# EAGLE design PlanktoscopeHat-v0.1-fab (EAGLE 9.6.2)
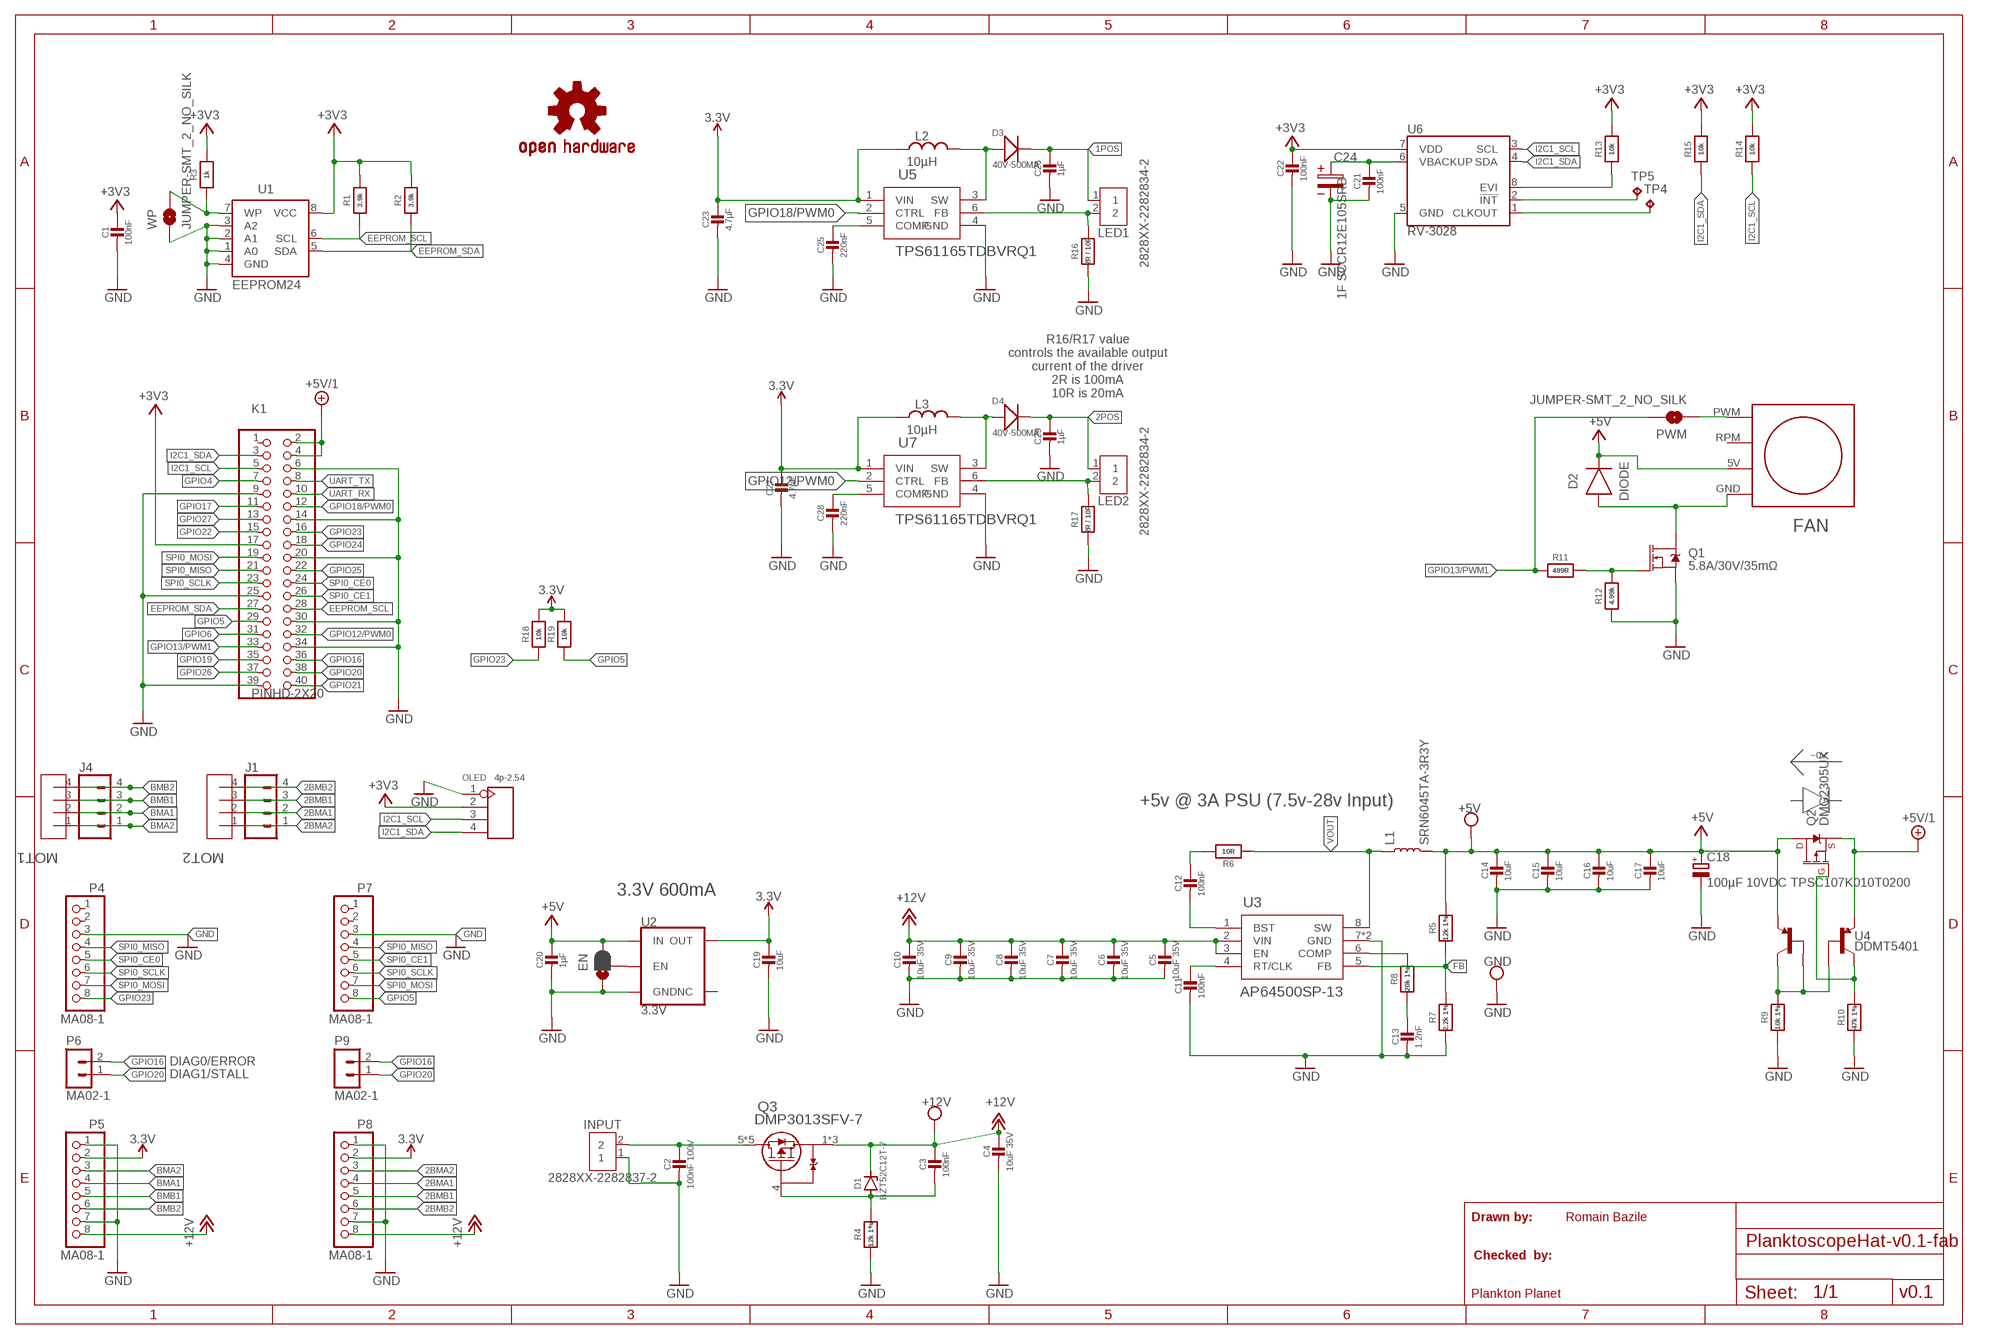
[diagram p0: schematic, sheet 1]

## Parts
+5V  TESTPOINTPAD2MM  [TESTPOINT_PAD_2MM]
+12V  TESTPOINTPAD2MM  [TESTPOINT_PAD_2MM]
C1  100nF  CAP_CERAMIC_0805MP  [_0805MP]
C2  100nF 100V  CAP_CERAMIC_0805MP  [_0805MP]
C3  100nF  CAP_CERAMIC_0805MP  [_0805MP]
C4  10uF 35V  CAP_CERAMIC_0805MP  [_0805MP]
C5  10uF 35V  CAP_CERAMIC_0805MP  [_0805MP]
C6  10uF 35V  CAP_CERAMIC_0805MP  [_0805MP]
C7  10uF 35V  CAP_CERAMIC_0805MP  [_0805MP]
C8  10uF 35V  CAP_CERAMIC_0805MP  [_0805MP]
C9  10uF 35V  CAP_CERAMIC_0805MP  [_0805MP]
C10  10uF 35V  CAP_CERAMIC_0805MP  [_0805MP]
C11  100nF  CAP_CERAMIC_0805MP  [_0805MP]
C12  100nF  CAP_CERAMIC_0805MP  [_0805MP]
C13  1.2nF  CAP_CERAMIC_0805MP  [_0805MP]
C14  10uF  CAP_CERAMIC_0805MP  [_0805MP]
C15  10uF  CAP_CERAMIC_0805MP  [_0805MP]
C16  10uF  CAP_CERAMIC_0805MP  [_0805MP]
C17  10uF  CAP_CERAMIC_0805MP  [_0805MP]
C18  100µF 10VDC TPSC107K010T0200  C-POL_TANTALUM-2412(6032-METRIC)  [CAPMP6032X280N]
C19  10uF  CAP_CERAMIC_0805MP  [_0805MP]
C20  1µF  CAP_CERAMIC_0805MP  [_0805MP]
C21  100nF  CAP_CERAMIC_0805MP  [_0805MP]
C22  100nF  CAP_CERAMIC_0805MP  [_0805MP]
C23  4.7µF  CAP_CERAMIC_0805MP  [_0805MP]
C24  1F SCCR12E105SRB  WCAP-PTHT_8X8_870135174001  [8X3.5X0.9(DXAXB)]
C25  220nF  CAP_CERAMIC_0805MP  [_0805MP]
C26  1µF  CAP_CERAMIC_0805MP  [_0805MP]
C27  4.7µF  CAP_CERAMIC_0805MP  [_0805MP]
C28  220nF  CAP_CERAMIC_0805MP  [_0805MP]
C29  1µF  CAP_CERAMIC_0805MP  [_0805MP]
D1  BZT52C12T-7  ZENER_SODFL(1608-METRIC)  [SODFL1608X70]
D2  DIODE  DIODEDO-214AC(SMA)  [DIOM5226X290N]
D3  40V-500MA  SMD-DIODE-SCHOTTKY-40V-500MA(SOD-123)  [SOD-123]
D4  40V-500MA  SMD-DIODE-SCHOTTKY-40V-500MA(SOD-123)  [SOD-123]
EN  JUMPER-SMT_3_1-NC_PASTE_SILK  [SMT-JUMPER_3_1-NC_PASTE_SILK]
FAN  40MM_FAN  [40MM_FAN]
GND  TESTPOINTPAD2MM  [TESTPOINT_PAD_2MM]
INPUT  2828XX-2282837-2  [TERMBLK_508-2N]
J1  CONN_04SCREW  [SCREWTERMINAL-3.5MM-4]
J4  CONN_04SCREW  [SCREWTERMINAL-3.5MM-4]
K1  PINHD-2X20  [2X20]
L1  SRN6045TA-3R3Y  INDUCTOR-SRN6045-33UH  [SRN6045]
L2  10µH  L_MOLDED-1210(3225-METRIC)  [INDM3225X240]
L3  10µH  L_MOLDED-1210(3225-METRIC)  [INDM3225X240]
LED1  2828XX-2282834-2  [TERMBLK_254-2N]
LED2  2828XX-2282834-2  [TERMBLK_254-2N]
LOGO1  OSHW-LOGOL-COPPER  [OSHW-LOGO-L_COPPER]
MOT1  S4B-XH-SM4-TB(LF)(SN)  [CONN_S4B-XH-SM4-TB_JST]
MOT2  S4B-XH-SM4-TB(LF)(SN)  [CONN_S4B-XH-SM4-TB_JST]
OLED  4p-2.54  DIP-BLACK-MALE-HEADER-VERT(4P-2.54)  [H4-2.54]
P4  MA08-1  PINHD-1X08_2.54-S  [1X08-S]
P5  MA08-1  PINHD-1X08_2.54-S  [1X08-S]
P6  MA02-1  [MA02-1]
P7  MA08-1  PINHD-1X08_2.54-S  [1X08-S]
P8  MA08-1  PINHD-1X08_2.54-S  [1X08-S]
P9  MA02-1  [MA02-1]
PWM  JUMPER-SMT_2_NO_SILK  [SMT-JUMPER_2_NO_SILK]
Q1  5.8A/30V/35mΩ  MOSFET-NCH-AO3404A  [SOT23-3]
Q2  DMG2305UX  MOSFET_PCH-DMG2305UX-7  [SOT23-3]
Q3  DMP3013SFV-7  [POWERDI3333-8_UX_DIO]
R1  3.9k  RESISTOR_0805MP  [_0805MP]
R2  3.9k  RESISTOR_0805MP  [_0805MP]
R3  1k  RESISTOR_0805MP  [_0805MP]
R4  12k 1%  RESISTOR_0805MP  [_0805MP]
R5  12k 1%  RESISTOR_0805MP  [_0805MP]
R6  10R  RESISTOR_0805MP  [_0805MP]
R7  2.2k 1%  RESISTOR_0805MP  [_0805MP]
R8  20k 1%  RESISTOR_0805MP  [_0805MP]
R9  10k 1%  RESISTOR_0805MP  [_0805MP]
R10  47k 1%  RESISTOR_0805MP  [_0805MP]
R11  499R  RESISTOR_0805MP  [_0805MP]
R12  4.99k  RESISTOR_0805MP  [_0805MP]
R13  10k  RESISTOR_0805MP  [_0805MP]
R14  10k  RESISTOR_0805MP  [_0805MP]
R15  10k  RESISTOR_0805MP  [_0805MP]
R16  2R / 10R  RESISTOR_0805MP  [_0805MP]
R17  2R / 10R  RESISTOR_0805MP  [_0805MP]
R18  10k  RESISTOR_0805MP  [_0805MP]
R19  10k  RESISTOR_0805MP  [_0805MP]
TP4  TPB1,27  [B1,27]
TP5  TPB1,27  [B1,27]
U1  EEPROM24  [SOIC8]
U2  3.3V  V_REG_AP2112K-3.3V  [SOT23-5]
U3  AP64500SP-13  [SO-8EP_DIO]
U4  DDMT5401  [SOT26]
U5  TPS61165TDBVRQ1  [DBV6]
U6  RV-3028  [RV-3028]
U7  TPS61165TDBVRQ1  [DBV6]
WP  JUMPER-SMT_2_NO_SILK  [SMT-JUMPER_2_NO_SILK]

## Nets
1POS: C26.1 D3.- LED1.1
2BMA1: J1.2 MOT2.2 P8.4
2BMA2: J1.1 MOT2.1 P8.3
2BMB1: J1.3 MOT2.3 P8.5
2BMB2: J1.4 MOT2.4 P8.6
2POS: C29.1 D4.- LED2.1
3.3V: C19.1 C23.1 C27.1 L2.1 L3.1 P5.2 P8.2 R18.2 R19.2 U2.5(OUT) U5.1(VIN) U7.1(VIN)
+3V3: C1.1 C22.1 K1.17 OLED.2 R1.2 R2.2 R3.2 R13.2 R14.2 R15.2 U1.8(VCC) U6.7(VDD)
+5V: +5V.P$1 C14.1 C15.1 C16.1 C17.1 C18.1(+) C20.1 D2.1(C) EN.3 FAN.5V(+5V) L1.2 Q2.3(D) R5.2 U2.1(IN) U4.D1
+5V/1: K1.2 K1.4 Q2.2(S) U4.S1
+12V: +12V.P$1 C3.1 C4.1 C5.1 C6.1 C7.1 C8.1 C9.1 C10.1 D1.1(C) P5.8 P8.8 Q3.1(S) Q3.2(S) Q3.3(S) U3.2(VIN) U3.3(EN)
/INT: TP5.TP U6.2(!INT)
BMA1: J4.2 MOT1.2 P5.4
BMA2: J4.1 MOT1.1 P5.3
BMB1: J4.3 MOT1.3 P5.5
BMB2: J4.4 MOT1.4 P5.6
CLKOUT: TP4.TP U6.1(CLKOUT)
COMP: R8.2 U3.6(COMP)
EEPROM_SCL: K1.28 R1.1 U1.6(SCL)
EEPROM_SDA: K1.27 R2.1 U1.5(SDA)
FB: R5.1 R7.2 U3.5(FB)
GND: C1.2 C2.2 C4.2 C5.2 C6.2 C7.2 C8.2 C9.2 C10.2 C11.2 C13.2 C14.2 C15.2 C16.2 C17.2 C18.2(-) C19.2 C20.2 C21.2 C22.2 C23.2 C24.2 C25.2 C26.2 C27.2 C28.2 C29.2 EN.1 GND.P$1 INPUT.1 K1.6 K1.9 K1.14 K1.20 K1.25 K1.30 K1.34 K1.39 OLED.1 P4.3 P5.1 P5.7 P7.3 P8.1 P8.7 Q1.2(S) R4.1 R7.1 R9.1 R10.1 R12.1 R16.1 R17.1 U1.1(A0) U1.2(A1) U1.3(A2) U1.4(GND) U2.2(GND) U3.7(GND) U3.EPAD(GND) U5.4(GND) U6.5(GND) U7.4(GND) WP.1
GPIO4: K1.7
GPIO5: K1.29 P7.8 R19.1
GPIO6: K1.31
GPIO12/PWM0: K1.32 U7.2(CTRL)
GPIO13/PWM1: K1.33 PWM.2 R11.1
GPIO16: K1.36 P6.2 P9.2
GPIO17: K1.11
GPIO18/PWM0: K1.12 U5.2(CTRL)
GPIO19: K1.35
GPIO20: K1.38 P6.1 P9.1
GPIO21: K1.40
GPIO22: K1.15
GPIO23: K1.16 P4.8 R18.1
GPIO24: K1.18
GPIO25: K1.22
GPIO26: K1.37
GPIO27: K1.13
I2C1_SCL: K1.5 OLED.3 R14.1 U6.3(SCL)
I2C1_SDA: K1.3 OLED.4 R15.1 U6.4(SDA)
N$3: R3.1 U1.7(WP) WP.2
N$5: C21.1 C24.1 U6.6(VBACKUP)
N$6: C3.2 D1.2(A) Q3.4(G) R4.2
N$7: EN.2 U2.3(EN)
N$8: D2.2(A) FAN.GND Q1.3(D)
N$9: C12.2 U3.1(BST)
N$10: C12.1 R6.2
N$12: Q2.1(G) R10.2 U4.D2
N$13: C11.1 U3.4(RT/CLK)
N$14: C13.1 R8.1
N$15: R9.2 U4.G1 U4.G2 U4.S2
N$17: Q1.1(G) R11.2 R12.2
N$19: FAN.PWM PWM.1
N$21: R13.1 U6.8(EVI)
N$22: C25.1 U5.5(COMP)
N$23: LED1.2 R16.2 U5.6(FB)
N$24: C28.1 U7.5(COMP)
N$25: D3.+ L2.2 U5.3(SW)
N$27: LED2.2 R17.2 U7.6(FB)
N$28: D4.+ L3.2 U7.3(SW)
SPI0_CE0: K1.24 P4.5
SPI0_CE1: K1.26 P7.5
SPI0_MISO: K1.21 P4.4 P7.4
SPI0_MOSI: K1.19 P4.7 P7.7
SPI0_SCLK: K1.23 P4.6 P7.6
UART_RX: K1.10
UART_TX: K1.8
VIN: C2.1 INPUT.2 Q3.5(D) Q3.6(D) Q3.7(D) Q3.8(D) Q3.9(D)
VOUT: L1.1 R6.1 U3.8(SW)
Unconnected: FAN.RPM K1.1 P4.1 P4.2 P7.1 P7.2 U2.4(NC)

## Notes on the sheet
- R16/R17 value
  controls the available output
  current of the driver
  2R is 100mA
  10R is 20mA
- ~0V
- +5v @ 3A PSU (7.5v-28v Input)
- 3.3V 600mA
- DIAG0/ERROR
- DIAG1/STALL
- Drawn by: | Romain Bazile
- Checked  by:
- Plankton Planet | v0.1

## Library data of the parts
+5V +12V GND = microbuilder:TESTPOINT: Test Point Various test points for characterisation and PCB testing TESTPOINT_SMT - Compact Surface Mount Test Point [Digikey: 5016KTR-ND]
C1 C21-C23 C25-C29 = microbuilder:CAP_CERAMIC: Ceramic Capacitors For new designs, use the packages preceded by an '_' character since they are more reliable: The following footprints should be used on most boards: _0402 - Standard footprint for regular board layouts _0603 - Standard footprint for regular board layouts _0805 - Standard footprint for regular board layouts _1206 - Standard footprint for regular board layouts For extremely tight-pitch boards where space is at a premium, the following 'micro-pitch' footprints can be used (smaller pads, no silkscreen outline, etc.): _0402MP - Micro-pitch footprint for very dense/compact boards _0603MP - Micro-pitch footprint for very dense/compact boards _0805MP - Micro-pitch footprint for very dense/compact boards _1206MP - Micro-pitch footprint for very dense/compact boards; DIELECTRIC: X7R
C2-C17 C19 C20 = microbuilder:CAP_CERAMIC: Ceramic Capacitors For new designs, use the packages preceded by an '_' character since they are more reliable: The following footprints should be used on most boards: _0402 - Standard footprint for regular board layouts _0603 - Standard footprint for regular board layouts _0805 - Standard footprint for regular board layouts _1206 - Standard footprint for regular board layouts For extremely tight-pitch boards where space is at a premium, the following 'micro-pitch' footprints can be used (smaller pads, no silkscreen outline, etc.): _0402MP - Micro-pitch footprint for very dense/compact boards _0603MP - Micro-pitch footprint for very dense/compact boards _0805MP - Micro-pitch footprint for very dense/compact boards _1206MP - Micro-pitch footprint for very dense/compact boards
C18 = Capacitor:C-POL: Capacitor Polarised - Generic; CATEGORY: Capacitor
C24 = Wurth_Elektronik_Passive_Capacitors_rev19a:WCAP-PTHT: WCAP-PTHT Aluminum Polymer Capacitors Characteristics Aluminum Polymer Capacitor Recommended soldering: Wave Operating temperature: -55°C to +125°C +125°C product series Low ESR at high frequency range Long life: 2000h @ +125°C Package name and Variant abbreviation: Package: D X A X B = Diameter of the outline X Pitch of the hole X Diameter of the hole. <http://katalog.we-online.de/media/images/eisos/WCAP-PTHT_pf2.jpg> Details see: http://katalog.we-online.de/en/pbs/WCAP-PTHT/ Created: 2015-02-06 2015 (C) Wurth Elektronik; WE-NUMBER: 870135174001/390uF
D1 = Diode:ZENER: Zener Diode - Generic; CATEGORY: Diode; SUB-CATEGORY: Zener; VALUE: ZENER
D2 = Diode:DIODE: Diode Rectifier - Generic; CATEGORY: Diode; SUB-CATEGORY: Rectifier
D3 D4 = OPL_Discrete_Semiconductor:SMD-DIODE-SCHOTTKY-40V-500MA(SOD-123): 304020012; MPN: B0540W
EN = SparkFun-Jumpers:JUMPER-SMT_3_1-NC_PASTE: Normally closed solder jumper (1 of 2 connections) This jumper has an aperture in the stencil to allow solder paste to bridge one of the two connections. One connection is normally closed (NC), while the other is normally open (NO). Wick off the solder to open the connection. Reapply solder to reclose the connection. Apply solder to the other side instead to change the current path.
FAN = PScope:40MM_FAN
INPUT = Connector:2828XX-2: 2 Position Wire to Board Terminal Block Horizontal with Board Datasheet <https://www.te.com.cn/commerce/DocumentDelivery/DDEController?Action=showdoc&DocId=Catalog+Section%7F1308389_EUROSTYLE_TERMINAL_BLOCKS%7F0607%7Fpdf%7FEnglish%7FENG_CS_1308389_EUROSTYLE_TERMINAL_BLOCKS_0607.pdf%7F2-282837-5>; CATEGORY: Connector; DESCRIPTION: 2 Position Wire to Board Terminal Block Horizontal with Board 5.08 mm Through Hole; MANUFACTURER: TE Connectivity; MPN: TC0203620000G; OPERATING_TEMPERATURE: -40°C to +105°C; PART_STATUS: ACTIVE; ROHS_COMPLIANCE: RoHS Compliant; SERIES: 282837; SUBCATEGORY: Terminal Block; TYPE: Side Wire Entry
J1 J4 = SparkFun-Connectors:CONN_04: Multi connection point. Often used as Generic Header-pin footprint for 0.1 inch spaced/style header connections On any of the 0.1 inch spaced packages, you can populate with these: Break Away Headers - Straight <https://www.sparkfun.com/products/116> (PRT-00116) Break Away Male Headers - Right Angle <https://www.sparkfun.com/products/553> (PRT-00553) Female Headers <https://www.sparkfun.com/products/115> (PRT-00115) Break Away Headers - Machine Pin <https://www.sparkfun.com/products/117> (PRT-00117) Break Away Female Headers - Swiss Machine Pin <https://www.sparkfun.com/products/743> (PRT-00743) For SCREWTERMINALS and SPRING TERMINALS visit here: Screw Terimnals on SparkFun.com <https://www.sparkfun.com/search/results?term=Screw+Terminals> (5mm/3.5mm/2.54mm spacing) This device is also useful as a general connection point to wire up your design to another part of your project. Our various solder wires solder well into these plated through hole pads. Hook-Up Wire - Assortment (Stranded, 22 AWG) <https://www.sparkfun.com/products/11375> (PRT-11375) Hook-Up Wire - Assortment (Solid Core, 22 AWG) <https://www.sparkfun.com/products/11367> (PRT-11367) View the entire wire category on our website here <https://www.sparkfun.com/categories/141> Special notes: Molex polarized connector foot print use with SKU : PRT-08231 with associated crimp pins and housings. 1MM SMD Version SKU: PRT-10208; PROD_ID: 2xCONN-08399; SF_ID: 2xPRT-08084
K1 = Connector:PINHD-2X20: PIN HEADER; CATEGORY: CONNECTOR; SUB-CATEGORY: PIN-HEADER
L1 = SparkFun-Coils:INDUCTOR: Inductors Resist changes in electrical current. Basically a coil of wire. SparkFun Products: SparkFun Load Cell Amplifier - HX711 <https://www.sparkfun.com/products/13879> IOIO-OTG - V2.2 <https://www.sparkfun.com/products/13613>; PROD_ID: NDUC-11627; VALUE: 33µH/±20%/1.4A
L2 L3 = Inductor:L: Inductor Fixed - Generic; CATEGORY: Inductor; MPN: CBC3225T100KR; SUB-CATEGORY: Fixed
LED1 LED2 = Connector:2828XX-2: 2 Position Wire to Board Terminal Block Horizontal with Board Datasheet <https://www.te.com.cn/commerce/DocumentDelivery/DDEController?Action=showdoc&DocId=Catalog+Section%7F1308389_EUROSTYLE_TERMINAL_BLOCKS%7F0607%7Fpdf%7FEnglish%7FENG_CS_1308389_EUROSTYLE_TERMINAL_BLOCKS_0607.pdf%7F2-282837-5>
LOGO1 = SparkFun-Aesthetics:OSHW-LOGO: Open-Source Hardware (OSHW) Logo This logo indicates the piece of hardware it is found on incorporates a OSHW license and/or adheres to the definition of open source hardware found here: http://freedomdefined.org/OSHW
MOT1 MOT2 = PScope:S4B-XH-SM4-TB(LF)(SN); BUILT_BY: EMA_Justin; COPYRIGHT: Copyright (C) 2018 Accelerated Designs. All rights reserved; DATASHEET: http://www.farnell.com/datasheets/1684882.pdf?_ga=2.23206330.1695985900.1582574926-861621671.1572890216&_gac=1.58313304.1582574926.CjwKCAiAhc7yBRAdEiwAplGxX0eXyKiGfj62eRMGG7KvwS8fdWH6vWjmriwTUSfyzPNlkVLVCkx_YhoCwGcQAvD_BwE; MANUFACTURER_PART_NUMBER: S4B-XH-SM4-TB(LF)(SN); SOURCELIBRARY: JST_2020-02-24; VENDOR: JST
OLED = OPL_Connector:DIP-BLACK-MALE-HEADER-VERT(4P-2.54): 320020017; MPN: P125-1104A0BS116A1
P4 P5 P7 P8 = pinhead-2:PINHD-1X08: PIN HEADER
P6 P9 = we-con:MA02-1: Pin Header
PWM WP = SparkFun-Jumpers:JUMPER-SMT_2_NO: Normally open jumper This jumper has two pads in close proximity to each other. Apply solder to close the connection. Round pads are easier to solder for beginners, but are a lot larger. SparkFun Product that uses the round pads: SparkFun EL Sequencer <https://www.sparkfun.com/products/12781>
Q1 = SparkFun-DiscreteSemi:MOSFET-NCH: N-channel MOSFETs Voltage controlled devices that allow control of high current outputs. SparkFun Products: SparkFun OpenScale <https://www.sparkfun.com/products/13261> SparkFun Digital Sandbox <https://www.sparkfun.com/products/12651> SparkFun Monster Moto Shield <https://www.sparkfun.com/products/10182> SparkFun MOSFET Power Controller <https://www.sparkfun.com/products/11214>; PROD_ID: TRANS-12988
Q2 = SparkFun-DiscreteSemi:MOSFET_PCH: P-channel MOSFETs Voltage controlled devices that allow control of high current outputs. SparkFun Products: SparkFun ESP32 Thing <https://www.sparkfun.com/products/13907> SparkFun ESP8266 Thing <https://www.sparkfun.com/products/13231> SparkFun Pi Servo HAT V2 <https://www.sparkfun.com/products/15316> DMG2305UX-7 (20V/4.2A/SOT23-3); PROD_ID: TRAN-14388; VALUE: 20V/4.2A/52mΩ/1.4W
Q3 = PScope:DMP3013SFV-7; BUILT_BY: EMA_Cory; COPYRIGHT: Copyright (C) 2018 Accelerated Designs. All rights reserved; DATASHEET: https://www.diodes.com/assets/Datasheets/DMP3013SFV.pdf; MANUFACTURER_PART_NUMBER: DMP3013SFV-7; SOURCELIBRARY: Diodes_Inc_2020-06-18; VENDOR: Diodes Inc
R1-R19 = microbuilder:RESISTOR: Resistors For new designs, use the packages preceded by an '_' character since they are more reliable: The following footprints should be used on most boards: _0402 - Standard footprint for regular board layouts _0603 - Standard footprint for regular board layouts _0805 - Standard footprint for regular board layouts _1206 - Standard footprint for regular board layouts For extremely tight-pitch boards where space is at a premium, the following 'micro-pitch' footprints can be used (smaller pads, no silkscreen outline, etc.): _0402MP - Micro-pitch footprint for very dense/compact boards _0603MP - Micro-pitch footprint for very dense/compact boards _0805MP - Micro-pitch footprint for very dense/compact boards _1206MP - Micro-pitch footprint for very dense/compact boards
TP4 TP5 = testpad:TP: Test pad
U1 = FLYFISH:EEPROM24
U2 = SparkFun-IC-Power:V_REG_AP2112: AP2112 - 600mA CMOS LDO Regulator w/ Enable The AP2112 is CMOS process low dropout linear regulator with enable function, the regulator delivers a guaranteed 600mA (min.) continuous load current. Features Output Voltage Accuracy: ±1.5% Output Current: 600mA (Min.) Foldback Short Current Protection: 50mA Enable Function to Turn ON/OFF VOUT Low Dropout Voltage (3.3V): 250mV (Typ.) @IOUT=600mA Excellent Load Regulation: 0.2%/A (Typ.) Excellent Line Regulation: 0.02%/V (Typ.) Low Quiescent Current: 55μA (Typ.) Low Standby Current: 0.01μA (Typ.) Low Output Noise: 50μVRMS PSRR: 100Hz -65dB, 1kHz -65dB OTSD Protection Stable with 1.0μF Flexible Cap: Ceramic, Tantalum and Aluminum Electrolytic Operation Temperature Range: -40°C to 85°C ESD: MM 400V, HBM 4000V; PROD_ID: VREG-12457
U3 = PScope:AP64500SP-13; BUILT_BY: EMA_Cory; COPYRIGHT: Copyright (C) 2018 Accelerated Designs. All rights reserved; DATASHEET: https://www.diodes.com/assets/Datasheets/AP64500.pdf; MANUFACTURER_PART_NUMBER: AP64500SP-13; SOURCELIBRARY: Diodes_Inc_2020-08-19; VENDOR: Diodes Inc
U4 = SparkFun-DiscreteSemi:DDMT5401
U5 U7 = PScope:TPS61165TDBVRQ1; DATASHEET_URL: http://www.ti.com/lit/gpn/TPS61165-Q1; DESCRIPTION: Automotive Catalog High Brightness White LED Driver in 2mm x 2mm QFN Package; FAMILY_NAME: WHITE LED DRIVER; GENERIC_PART_NUMBER: TPS61165-Q1; INDUSTRY_STD_PKG_TYPE: SOT-23; MANUFACTURER: Texas Instruments; MANUFACTURER_PART_NUMBER: TPS61165TDBVRQ1; PACKAGE_DESIGNATOR: DBV; PIN_COUNT: 6; VENDOR: Texas Instruments
U6 = SparkFun-Clocks:RV-3028: RV-3028 - RTC with I2C Bus Specifications: Pin count: 8 Pin pitch: .9mm Area: [3.2mm x 2.0mm] Datasheet referenced for footprint <https://www.microcrystal.com/fileadmin/Media/Products/RTC/App.Manual/RV-3028-C7_App-Manual.pdf>; PROD_ID: IC-14378

## Board
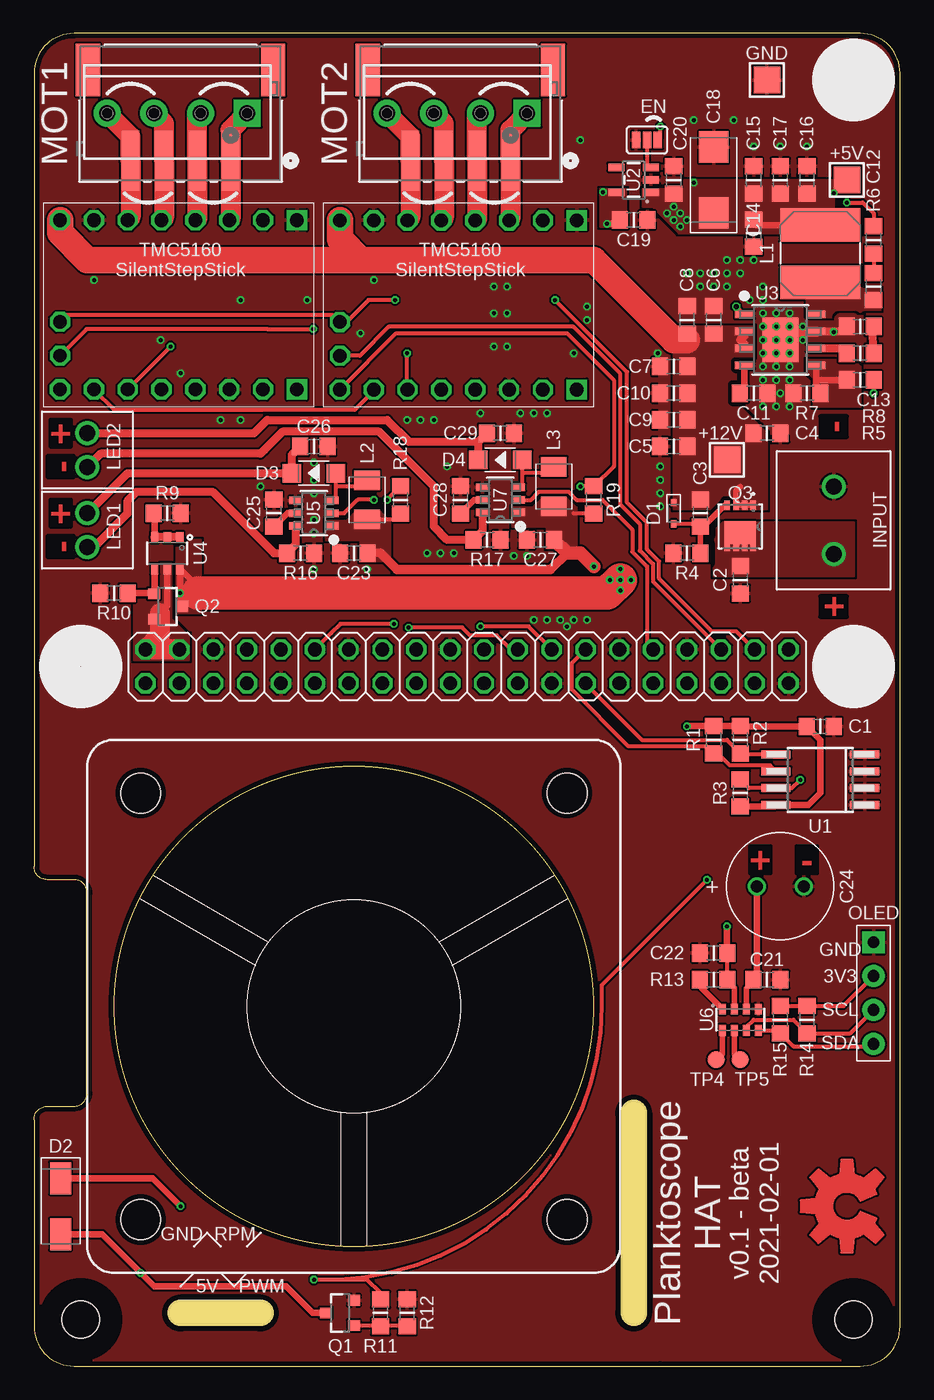
[diagram p1: board, top side]
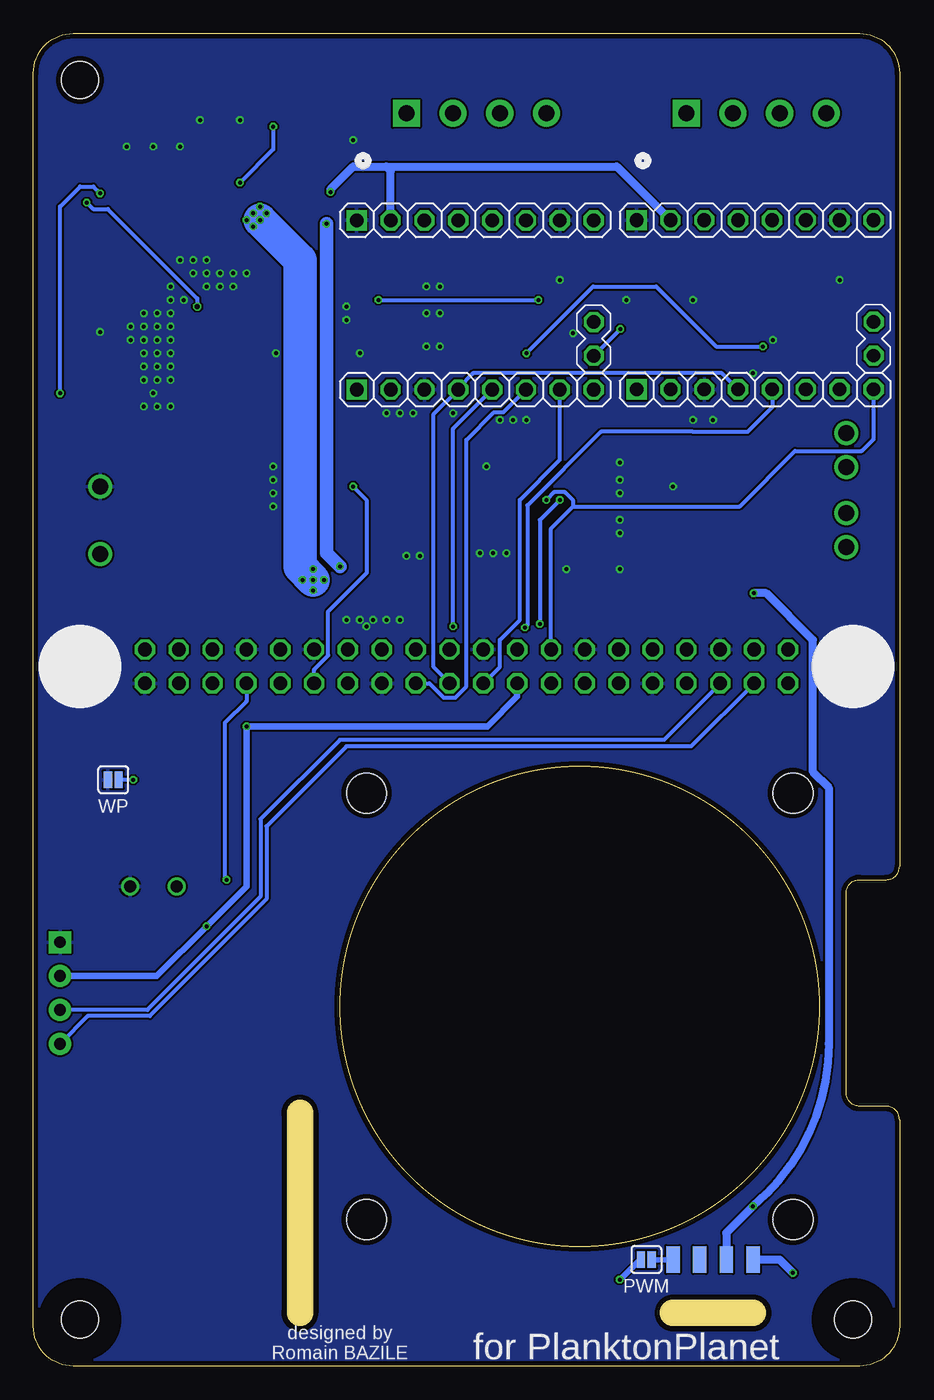
[diagram p2: board, bottom side, seen from below]

Size 65 x 100 mm. Coordinates in mm from the lower left corner, seen from the top.
Outline: 45,19 45,4
Outline: 0,3 arc90 3,0 47,0 62,0 arc90 65,3 65,97 arc90 62,100 3,100 arc90 0,97 0,37.5 arc90 1,36.5 3,36.5 arc-90 4,35.5 4,20.5 arc-90 3,19.5 1,19.5 arc90 0,18.5 0,3
Outline: circle at 24,27 radius 18
Copper layers (1*16): Top 0.035559375mm / dielectric 1.6mm / Bottom 0.035559375mm
Design rules "oshpark-2layer *": minimum track width 6mil, minimum drill 10mil, track to track 6mil, track to pad 6mil, pad to pad 6mil, via to via 6mil, smd to smd 0mil, copper to edge 15mil, drill to drill 6mil, minimum pad ring 5mil, minimum via ring 5mil, stop-mask expansion 2.5mil, vias tented up to drill 0.35mm, thermal gap 6mil
Holes 2.8 mm at 3.5,3.5 3.5,52.5 61.5,52.5 61.5,3.5 61.5,96.5
tRestrict: area 60,1.9 to 63,5; area 1.9,1.9 to 5,5
bRestrict: area 1.9,1.9 to 5,5; area 60,1.9 to 63,5
Milling: 1 lines

### Footprints (pad centres in the part's own frame; a part is rotated, then mirrored left to right if it is on the bottom)
TESTPOINT_PAD_2MM = smd 2 x 2: P$1 0,0
_0805MP = smd 1.2 x 1.3: 1 -1.016,0; 2 1.016,0
CAPMP6032X280N = smd 2.368 x 2.204: 1 -2.471,0; 2 2.471,0
8X3.5X0.9(DXAXB) = drill 0.9: 1 1.75,0; 2 -1.75,0
SODFL1608X70 = smd 0.538 x 0.4: 1 -0.796,0; 2 0.796,0
DIOM5226X290N = smd 2.392 x 1.565: 1 -2.108,0; 2 2.108,0
SOD-123 = smd 1.397 x 1.397: + -1.651,0; - 1.651,0
SMT-JUMPER_3_1-NC_PASTE_SILK = smd 0.635 x 1.27: 1 -0.813,0; 2 0,0; 3 0.813,0
40MM_FAN = smd 1 x 2 bottom: 5V 11,19; GND 13,19; PWM 7,19; RPM 9,19 | hole 3: -16,16; 16,16; 16,-16; -16,-16
TERMBLK_508-2N = drill 1.2: 1 0,0; 2 5.08,0
SCREWTERMINAL-3.5MM-4 = drill 1.2 pad 2.032 square: 1 0,0 | drill 1.2 pad 2.032: 2 3.5,0; 3 7,0; 4 10.5,0
2X20 = drill 1.016 octagon: 1 -24.13,-1.27; 2 -24.13,1.27; 3 -21.59,-1.27; 4 -21.59,1.27; 5 -19.05,-1.27; 6 -19.05,1.27; 7 -16.51,-1.27; 8 -16.51,1.27; 9 -13.97,-1.27; 10 -13.97,1.27; 11 -11.43,-1.27; 12 -11.43,1.27; 13 -8.89,-1.27; 14 -8.89,1.27; 15 -6.35,-1.27; 16 -6.35,1.27; 17 -3.81,-1.27; 18 -3.81,1.27; 19 -1.27,-1.27; 20 -1.27,1.27; 21 1.27,-1.27; 22 1.27,1.27; 23 3.81,-1.27; 24 3.81,1.27; 25 6.35,-1.27; 26 6.35,1.27; 27 8.89,-1.27; 28 8.89,1.27; 29 11.43,-1.27; 30 11.43,1.27; 31 13.97,-1.27; 32 13.97,1.27; 33 16.51,-1.27; 34 16.51,1.27; 35 19.05,-1.27; 36 19.05,1.27; 37 21.59,-1.27; 38 21.59,1.27; 39 24.13,-1.27; 40 24.13,1.27
SRN6045 = smd 2.5 x 6: 1 -2.175,0; 2 2.125,0
INDM3225X240 = smd 1.459 x 1.929: 1 -1.478,0; 2 1.478,0
TERMBLK_254-2N = drill 1.2: 1 0,0; 2 2.54,0
CONN_S4B-XH-SM4-TB_JST = smd 1.295 x 4.496: 1 -3.75,3.552; 2 -1.25,3.552; 3 1.25,3.552; 4 3.75,3.552 | smd 1.803 x 3.912: 5 -6.95,-3.248; 6 6.95,-3.248
H4-2.54 = drill 0.889 pad 1.651 square: 1 0,3.81 | drill 0.889 pad 1.651: 2 0,1.27; 3 0,-1.27; 4 0,-3.81
1X08-S = drill 1.016 square: 1 -8.89,0 | drill 1.016 octagon: 2 -6.35,0; 3 -3.81,0; 4 -1.27,0; 5 1.27,0; 6 3.81,0; 7 6.35,0; 8 8.89,0
MA02-1 = drill 1 octagon: 1 0,1.27; 2 0,-1.27
SMT-JUMPER_2_NO_SILK = smd 0.635 x 1.27: 1 -0.406,0; 2 0.406,0
SOT23-3 = smd 0.8 x 0.9: 1 -0.95,-1; 2 0.95,-1; 3 0,1.1
POWERDI3333-8_UX_DIO = smd 0.7 x 0.42: 1 -1.598,0.975; 2 -1.598,0.325; 3 -1.598,-0.325; 4 -1.598,-0.975 | smd 0.54 x 0.42: 5 1.578,-0.975; 6 1.578,-0.325; 7 1.578,0.325; 8 1.578,0.975 | smd 1.71 x 2.37: 9 0.455,0
B1,27 = smd 1.27 x 1.27: TP 0,0
SOIC8 = smd 0.6 x 2.2: 1 -1.905,-3.33; 2 -0.635,-3.33; 3 0.635,-3.33; 4 1.905,-3.33; 5 1.905,3.33; 6 0.635,3.33; 7 -0.635,3.33; 8 -1.905,3.33
SOT23-5 = smd 0.55 x 1.2: 1 -0.95,-1.3; 2 0,-1.3; 3 0.95,-1.3; 4 0.95,1.3; 5 -0.95,1.3
SO-8EP_DIO = smd 1.417 x 0.558: 1 -2.69,1.905; 2 -2.69,0.635; 3 -2.69,-0.635; 4 -2.69,-1.905; 5 2.69,-1.905; 6 2.69,-0.635; 7 2.69,0.635; 8 2.69,1.905 | smd 2.718 x 3.353: EPAD 0,0
SOT26 = smd 0.55 x 0.8: D1 -0.95,1.2; D2 0.95,1.2; G1 -0.95,-1.2; G2 0.95,-1.2; S1 0,1.2; S2 0,-1.2
DBV6 = smd 0.972 x 0.558: 1 -1.362,0.95; 2 -1.362,0; 3 -1.362,-0.95; 4 1.362,-0.95; 5 1.362,0; 6 1.362,0.95
RV-3028 = smd 0.5 x 0.8: 1 -1.35,-0.8; 2 -0.45,-0.8; 3 0.45,-0.8; 4 1.35,-0.8; 5 1.35,0.8; 6 0.45,0.8; 7 -0.45,0.8; 8 -1.35,0.8

### Placement (x,y rotation side)
+5V  61,89 270 top
+12V  52,68 90 top
C1  59,48 0 top
C2  53,59 270 top
C3  50,64 270 top
C4  55,70 0 top
C5  48,69 180 top
C6  51,78.5 90 top
C7  48,75 180 top
C8  49,78.5 90 top
C9  48,71 180 top
C10  48,73 180 top
C11  54,73 0 top
C12  63,84.5 90 top
C13  62,78 180 top
C14  54,85 270 top
C15  54,89 90 top
C16  58,89 90 top
C17  56,89 90 top
C18  51,89 90 top
C19  45,86 0 top
C20  48,89 90 top
C21  55,29 0 top
C22  51,31 180 top
C23  24,61 180 top
C24  56,36 180 top
C25  18,64 90 top
C26  21,69 0 top
C27  38,62 180 top
C28  32,65 90 top
C29  35,70 0 top
D1  48,64 270 top
D2  2,12 270 top
D3  21,67 180 top
D4  35,68 180 top
EN  46,92 0 top
FAN  24,27 180 top
GND  55,96.5 270 top
INPUT  60,66 270 top
J1  37,94 180 top
J4  16,94 180 top
K1  32.5,52.5 0 top
L1  59,83.5 90 top
L2  25,65 90 top
L3  39,66 90 top
LED1  4,64 270 top
LED2  4,70 270 top
LOGO1  61,12 90 top
MOT1  11,94 180 top
MOT2  32,94 180 top
OLED  63,28 0 top
P4  10.84,73.28 0 bottom
P5  10.84,85.98 0 bottom
P6  1.95,77.09 0 bottom
P7  31.84,73.27 0 bottom
P8  31.84,85.97 0 bottom
P9  22.95,77.08 0 bottom
PWM  19,8 180 bottom
Q1  23,4 90 top
Q2  10,57 270 top
Q3  53,63 270 top
R1  51,47 90 top
R2  53,47 90 top
R3  53,43.01 270 top
R4  49,61 0 top
R5  62,74 0 top
R6  63,81 90 top
R7  58,73 0 top
R8  62,76 180 top
R9  10,64 180 top
R10  6,58 0 top
R11  26,4 270 top
R12  28,4 270 top
R13  51,29 0 top
R14  58,26 90 top
R15  56,26 90 top
R16  20,61 180 top
R17  34,62 180 top
R18  27.5,65 270 top
R19  42,65 270 top
TP4  51.2,23 0 top
TP5  53,23 0 top
U1  59,44 90 top
U2  45,89 90 top
U3  56,77 0 top
U4  10,61 180 top
U5  21,64 180 top
U6  53,26 0 top
U7  35,65 180 top
WP  59,44 0 bottom

### Tracks (layer width: path | path; a pad name or v marks a point on that pad's centre or on a via)
1POS
  Top 0.6: LED1.1 4.03,64 7.03,67 D3.- 19.35,68.36 C26.1
2BMA1
  Top 1.5: J1.2 33.25,93.75 MOT2.2 33.25,86.11 P8.4
2BMA2
  Top 1.5: J1.1 35.75,92.75 MOT2.1 35.75,86.07 P8.3
2BMB1
  Top 1.5: J1.3 30.75,93.25 MOT2.3 30.75,86.15 P8.5
2BMB2
  Top 1.5: J1.4 28.25,92.25 MOT2.4 28.25,86.19 P8.6
2POS
  Top 0.6: LED2.1 16.5,70 17.5,71 26.5,71 28.14,69.36 33.35,69.36 | D4.- 33.35,69.36 | 33.35,69.36 C29.1
3.3V  (via drill 0.3)
  Top 0.3: R19.2 40.52,63.98 40.5,64 | R18.2 27.04,63.52 L2.1
  Top 0.5: C19.1 43.68,85.7 v43,85.7
  Top 0.6: 26,61 C23.1
  Top 0.7: 40.02,61 38.77,59.75 27.25,59.75 26,61
  Top 1: v42,60 41,61 40.02,61 C27.1
  Bottom 0.6: v42.7,88.1 42.7,88.3 41,90 38.5,90 | P5.2 21.21,90 38.5,90 | P8.2 38.19,89.69 38.5,90
  Bottom 1: v43,85.7 43,61 v42,60
  pour Top (isolate 0.3, no thermals): 44.4,88.3 42.5,88.3 42.5,85.5 44.4,85.5
  pour Top (no thermals): 21.9,63.4 23.4,63.4 24.1,64.1 26,64.1 26.7,63.4 26.7,60.4 24.5,60.4 24.5,62 21.9,62
  pour Top (no thermals): 35.9,64.4 37.4,64.4 38.1,65.1 40,65.1 40.7,64.4 40.7,61.4 38.5,61.4 38.5,63 35.9,63
+3V3  (via drill 0.3)
  Top 0.3: R13.2 C22.1 | R15.2 R14.2 60.75,27.02 OLED.2
  Top 0.4: U6.7 52.55,28.37 R13.2
  Top 0.5: R3.2 55.56,41.99 U1.8 58.09,42.09 59,43 59,46.98 C1.1 53.02,48 R2.2 R1.2 49.02,48.02 v49,48 | v52,33 52,31.02 C22.1
  Bottom 0.5: K1.17 28.69,50.23 30.92,48 v49,48 49,36 v52,33 55.73,29.27 OLED.2
+5V  (via drill 0.3)
  Top 0.3: EN.3 47,92.19 v47,93 | R5.2 63,73.92 v63,73 | v43.2,59 v44,59 | v44,59.8 v44,59 | v44.8,59 v44,59 | v44,58.2 v44,59
  Top 0.5: Q2.3 10.95,57.15 v10.95,58 U4.D1 12.3,58.45 12.3,58 | L1.2 54.25,85.62 C14.1 | D2.1 6,14.11 8.89,14.11 v11,12
  Top 2.5: 12.3,58 39,58 43,58 v44,59
  Bottom 0.3: v47,93 47,91.3 v49.5,88.8 | v63,73 63,87 61.5,88.5 60.5,88.5 v60,88
  Bottom 0.6: v10.95,58 10,58 6.5,54.5 6.5,44.58 5.32,43.4 5.32,24.18 arc50 v11,12 13,10 FAN.5V
  Bottom 2.5: v44,59 45,60 45,83 v48,86
  other vias: 49,86 48,87 48.5,86.5 47.5,86.5 48.5,85.5
  pour Top (no thermals): 60,85 48.4,85 46.4,87 45.7,87 45.7,88.3 48.8,88.3 48.8,89 60,89
  pour Top (isolate 0.3, no thermals): 10.7,56.5 12.5,56.5 12.5,62 10.7,62
+5V/1
  Top 0.5: U4.S1 10,57.05 9.47,56.52 9.45,56.5 Q2.2
  Top 1.5: 9.45,56.5 9.45,54.85 K1.2 K1.4
  pour Top (no thermals): 9.5,60.2 10.3,60.2 10.3,56.1 11.5,54.9 11.6,54.9 11.6,53 7.5,53 7.5,57.5 9.5,57.5
+12V
  Top 0.4: Q3.1 Q3.2 Q3.3 52.67,65.67 53,66
  Top 0.6: U3.3 53.31,76.69 53,77 53.31,77.31 U3.2
  Top 2: 49,77 48,77 42,83 24.5,83 | P5.8 1.95,85.05 4,83 24.5,83 | P8.8 22.95,84.55 24.5,83
  pour Top (isolate 0.3, no thermals): 53,75 53,72 55,70 55,64.3 48,64.3 48,78 54,78 54,75
/INT
  Top 0.4: U6.2 52.55,23.45 TP5.TP
BMA1
  Top 1.5: J4.2 12.25,93.75 MOT1.2 12.25,86.12 P5.4
BMA2
  Top 1.5: J4.1 14.75,92.75 MOT1.1 14.75,86.08 P5.3
BMB1
  Top 1.5: J4.3 9.75,93.25 MOT1.3 9.75,86.16 P5.5
BMB2
  Top 1.5: J4.4 7.25,92.25 MOT1.4 7.25,86.2 P5.6
CLKOUT
  Top 0.4: U6.1 51.65,23.45 TP4.TP
COMP
  Top 0.6: U3.6 60.72,76.36 R8.2
EEPROM_SCL
  Top 0.3: K1.28 40.33,52.71 40.33,51 | 40.33,50.79 40.33,51 | 40.33,51 40.33,50.79 | 40.33,50.79 44.57,46.55 50.44,46.55 R1.1 51.32,45.98 52.23,45.08 55.22,45.08 U1.6
EEPROM_SDA
  Top 0.3: K1.27 45.62,47 52,47 53,46 R2.1 53.08,45.91 U1.5
FB
  Top 0.5: U3.5 58.69,75 58.69,74 | 58.69,74 58.69,73.23 R7.2 | R5.1 58.69,74
  pour Top (no thermals): 58,75.5 61.5,75.5 62,75 62,72 58.5,72 58.5,74.1 58,74.6
GND  (via drill 0.3)
  Top 0.5: 55.7,77.64 v55.7,77
  Top 0.6: C13.2 60.76,77.64 U3.7
  Top 0.8: U3.7 55.7,77.64
  other vias: 54.7,79 55.7,79 55.7,75 56.7,75 54.7,75 56.7,79 57.7,77 60,77.6 54.7,78 54.7,77 54.7,76 55.7,78 55.7,76 56.7,76 56.7,77 56.7,78 57.7,78 54.7,80 53.7,80 55.7,74 56.7,74 56,73 51,81 54,83 52,81 50,81 54.7,81 51,82 52,83 52,82 53,82 53,83 39.5,56 30.5,61 36,60.8 40.5,56 41.5,56 29.5,61 21,62.5 37,60.8 25,59.8 21,59.8 21,67.8 28,71 29,71 30,71 33.5,71.5 36.5,71.5 37.5,71.5 31.5,61 21,63.5 21,65.5 21,66.5 17,66 31,67.5 38.5,71.5 47,67.5 47,66.5 47,65.5 50,82 49,82 58,91.5 56,91.5 54,91.5 49.5,93.5 52.5,93.5 25.5,81.5 4.5,81.5 11,74.5 9.5,77 15.5,71 14,71 38.5,56 37.5,56 40,55.5 54.7,74 56.7,72 55.7,72 54.7,72 34.5,79 35.5,79 34.5,81 35.5,81 34.5,76.5 35.5,76.5 24.5,77.5 20.5,80 15.5,80 41,92 40.5,76 41.5,78.5 46.8,76 41.5,79.5 47,64.5
  pour Bottom: 0,3 arc90 3,0 62,0 arc90 65,3 65,97 arc90 62,100 3,100 arc90 0,97
  pour Top (rank 2): 0,3 arc90 3,0 62,0 arc90 65,3 65,97 arc90 62,100 3,100 arc90 0,97
  pour Top (rank 2, no thermals): 47,81 62,81 62,70 47,70
GPIO5  (via drill 0.3)
  Top 0.3: v41,66 41.02,66.02 R19.1 42.02,66.02 43.5,67.5 43.5,74 40,77.5 27.18,77.5 P7.8
  Bottom 0.3: K1.29 43.93,52.27 42.87,53.33 42.87,56.63 40,59.5 40,65 v41,66
GPIO12/PWM0
  Top 0.3: U7.2 37.29,65 37.89,65.6 40.11,65.6 40.71,65 42.66,65 44.9,62.76 44.9,61.1 46,60 46,54.24 K1.32
GPIO13/PWM1  (via drill 0.3)
  Top 0.3: R11.1 26,5.5 25,6.5 v21,6.5 arc93 42.58,27 42.58,28.58 v50.5,36.5
  Bottom 0.3: K1.33 49.01,49.88 50.63,48.26 50.63,36.63 v50.5,36.5
  Bottom 0.4: v21,6.5 19.5,8 PWM.2
GPIO16  (via drill 0.3)
  Top 0.3: P6.2 3.95,77.82 17.5,77.81 v20.95,77.81 | K1.36 46.45,58.87 46.45,60.19 45.45,61.19 45.45,63.19 44,64.64 44,74.46 40.48,77.98 26.62,77.98 24.45,75.81 P9.2
  Bottom 0.3: v20.95,77.81 P9.2
GPIO18/PWM0  (via drill 0.3)
  Top 0.3: U5.2 23.29,64 24.29,65 v25.5,65 | v27,55.7 26.7,55.7 23,55.7 22.3,55 K1.12
  Bottom 0.3: v25.5,65 27,63.5 v27,55.7
GPIO20  (via drill 0.3)
  Top 0.3: P6.1 2.45,78.86 22.45,78.85 P9.1 23.45,78.35 25.1,80 v27.1,80 | K1.38 54.05,53.77 52.69,55.13 50.87,55.13 46.91,59.09 46.91,60.38 46,61.28 46,63.28 44.5,64.78 44.5,74.6 v39.1,80
  Bottom 0.3: v39.1,80 v27.1,80
GPIO23  (via drill 0.3)
  Top 0.3: v26.5,65 26.5,65.02 R18.1
  Bottom 0.3: K1.16 26.15,62.85 24.5,64.5 24.49,64.5 24.47,64.5 | 24.47,64.5 24.47,64.93 25.12,65.58 25.92,65.58 v26.5,65 | P4.8 1.95,69.55 2.84,68.66 7.84,68.66 12,64.5 24.47,64.5
I2C1_SCL
  Top 0.3: U6.3 53.45,25.45 54,26 56.98,26 R14.1 61.25,24.98 OLED.3
  Bottom 0.3: K1.5 17.68,47 39,47 42,47 47.95,41.05 47.95,35.23 56.45,26.73 OLED.3
I2C1_SDA
  Top 0.3: OLED.4 62.81,24 56.98,24 R15.1 55.78,25.2 U6.4
  Bottom 0.3: K1.3 15.64,46.5 41.5,46.5 47.49,40.51 47.49,35.05 56.26,26.28 60.91,26.28 OLED.4
N$3  (via drill 0.3)
  Top 0.3: R3.1 53.65,43.37 U1.7 56.87,43.37 v57.5,44
  Bottom 0.3: v57.5,44 WP.2
N$5
  Top 0.4: U6.6 53.45,28.32 C21.1
  Top 0.5: C21.1 54.25,29.27 C24.1
N$6
  Top 0.3: D1.2 50,63.2 C3.2
  Top 0.4: Q3.4 51.83,64.6 50.35,63.12 C3.2 50,61.08 R4.2
N$7
  Top 0.3: EN.2 46,89.95 U2.3
N$8  (via drill 0.3)
  Top 0.5: Q1.3 20.9,4 18.9,6 9,6 v8,7 5.11,9.89 D2.2
  Bottom 0.6: v8,7 9,8 FAN.GND
N$9  (via drill 0.3, 0.35)
  Top 0.3: v52.7,79.5 U3.1 | v60.99,87.31 62.19,87.31 63,86.5 C12.2
  Bottom 0.3: v52.7,79.5 52.7,80.1 59.41,86.81 60.49,86.81 v60.99,87.31
N$10
  Top 0.3: C12.1 R6.2
N$12
  Top 0.5: U4.D2 9.05,59 9.05,58 | 9.05,58 Q2.1 | R10.2 9.05,58
N$13
  Top 0.5: U3.4 53.31,73.19 C11.1
N$14
  Top 0.6: R8.1 62.92,77.96 C13.1
N$15
  Top 0.5: R9.2 9.05,63.93 U4.G2
  Top 0.6: U4.G1 U4.S2 U4.G2
N$17
  Top 0.3: R11.2 25.97,3.05 | 25.97,3.05 Q1.1 | R12.2 27.97,3.05 25.97,3.05
N$19
  Bottom 0.4: PWM.1 FAN.PWM
N$21
  Top 0.4: U6.8 50.08,28.37 R13.1
N$22
  Top 0.5: C25.1 19.02,64 U5.5
N$23
  Top 0.6: LED1.2 4.5,61.46 7,63.96 7,64.91 7.7,65.6 13.4,65.6 18,61 R16.2 19.64,61.65 U5.6
N$24
  Top 0.5: U7.5 33.02,65 C28.1
N$25
  Top 0.3: U5.3 22.65,65.24 22.65,66 | 22.65,66 D3.+ | L2.2 24.52,66 22.65,66
N$27
  Top 0.6: U7.6 33.64,62.65 R17.2 31,62 30,63 30,66 25.9,70.1 18.64,70.1 17.27,68.73 17,68.46 5,68.46 LED2.2
N$28
  Top 0.3: U7.3 36.65,65.95 36.65,67 | 36.65,67 D4.+ | L3.2 39,67 36.65,67
SPI0_CE0  (via drill 0.3)
  Top 0.3: K1.24 35.77,53.77 34.71,54.83 32.71,54.83 32.12,55.42 v28.12,55.42
  Bottom 0.3: v28.12,55.42 27.92,55.62 27.92,64.58 22.39,70.11 15.5,70.11 11.39,70.11 9.5,72 9.5,73.21 P4.5
SPI0_CE1  (via drill 0.3)
  Top 0.3: K1.26 37.12,55.5 v33.5,55.5
  Bottom 0.3: v33.5,55.5 33.5,70.34 P7.5
SPI0_MISO
  Bottom 0.3: K1.21 33.77,51.27 35,52.5 35,71.38 P7.4 33.11,73.39 32,74.5 13.33,74.5 P4.4
SPI0_MOSI
  Top 0.3: P7.7 25.49,73.17 24.08,71.75 6.02,71.75 P4.7
  Bottom 0.3: K1.19 30,52.46 30,54.5 28.5,56 28.5,65 25.49,68.01 P7.7
SPI0_SCLK  (via drill 0.3)
  Top 0.3: P4.6 v10.25,76.5 | P7.6 28,73.3 v28,76
  Bottom 0.3: K1.23 35.27,51.23 34.21,50.17 33.33,50.17 32.5,50.99 32.5,69.5 30.42,71.58 29.72,71.58 P7.6 | v28,76 23,81 18.25,81 13.75,76.5 v10.25,76.5
VIN
  Top 0.5: Q3.6 Q3.9
  pour Top (isolate 0.5, no thermals): 51,59.3 51,63.3 61.5,63.3 61.5,59.3
VOUT
  pour Top (isolate 0.5, no thermals): 63.5,81.6 58,81.6 58,78.7 63.5,78.7

### Text on the board
Top: + | - | - | + | - | + | + | -
tNames: TMC5160 / SilentStepStick | TMC5160 / SilentStepStick | GND | 3V3 | SCL | SDA | Planktoscope / HAT | v0.1 - beta / 2021-02-01 | GND | RPM | 5V | PWM
bNames: for PlanktonPlanet | designed by / Romain BAZILE
Document: GND | Vio | BMB2 | BMB1 | BMA1 | BMA2 | GND | Vm | DIAG1 | DIAG0 | Dir | Step | DCO | SDO/CFG0 | CSN/CFG3 | SCK/CFG2 | SDI/CFG1 | EN | GND | Vio | BMB2 | BMB1 | BMA1 | BMA2 | GND | Vm | DIAG1 | DIAG0 | Dir | Step | DCO | SDO/CFG0 | CSN/CFG3 | SCK/CFG2 | SDI/CFG1 | EN